# EAGLE design TL2P2 (EAGLE 7.7.0)
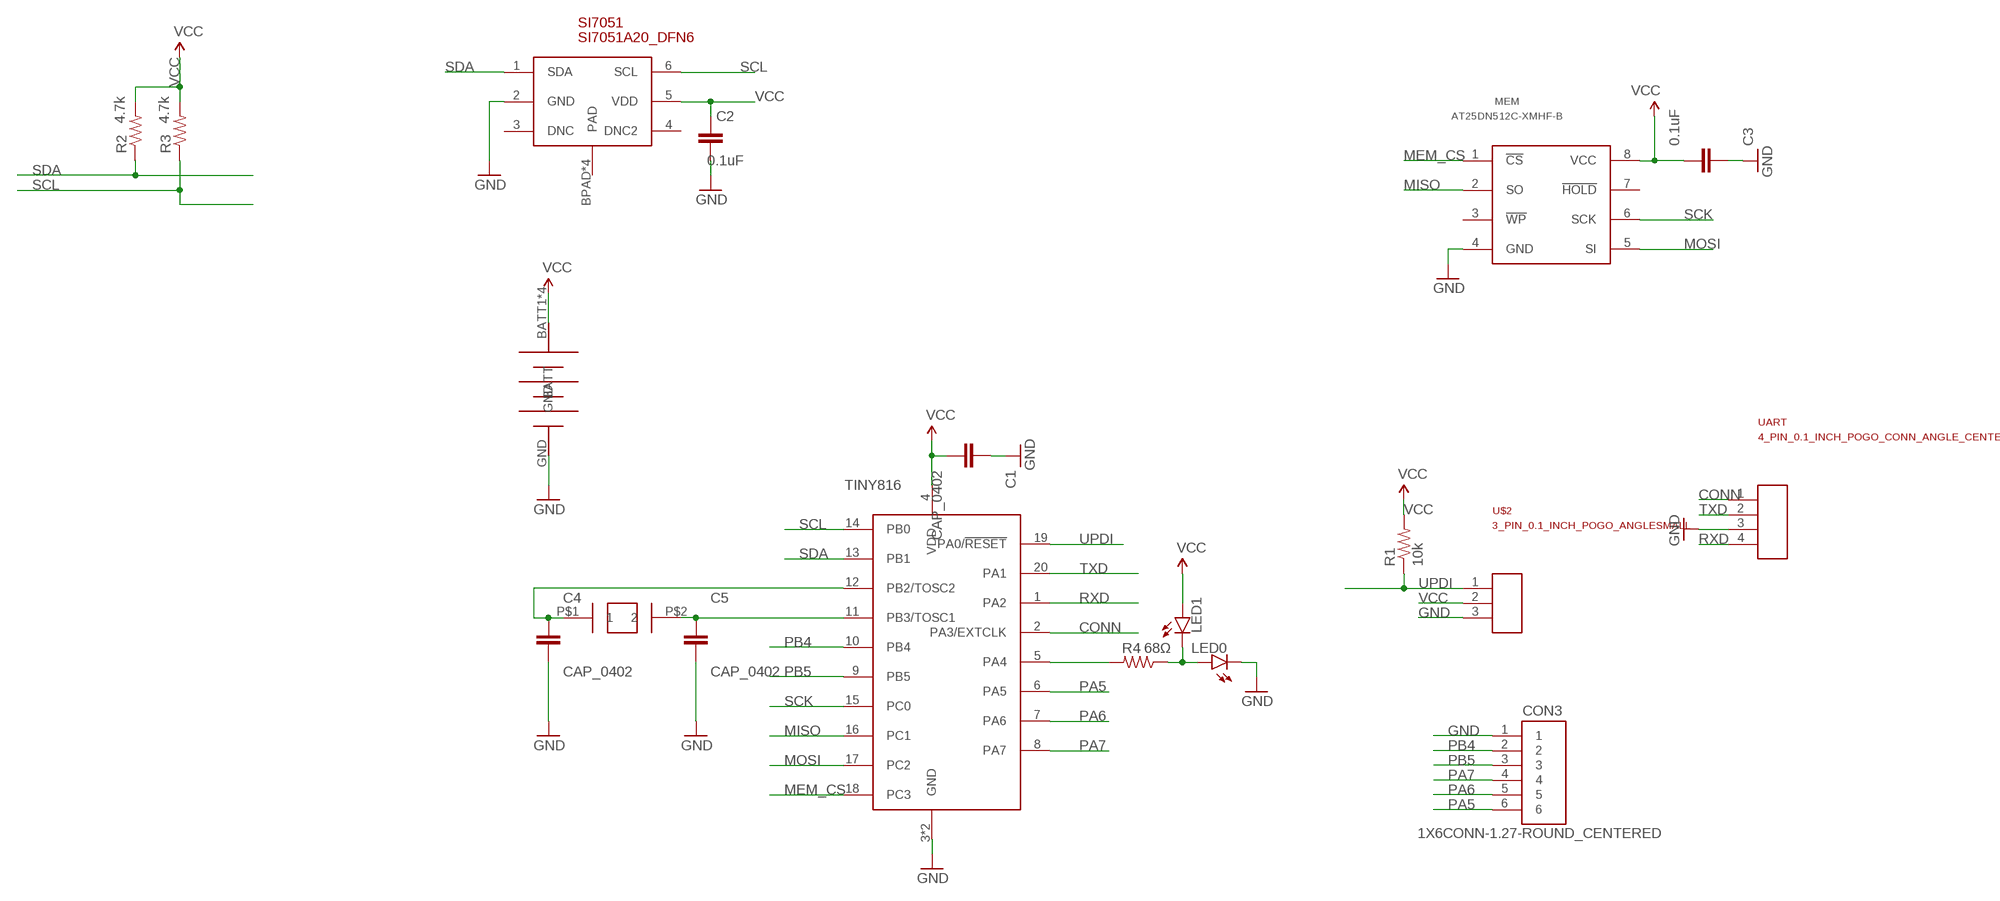
[diagram p0: schematic, sheet 1]

## Parts
C1  CAP_0402  [SMD_0402]
C2  0.1uF  CAP_0402  [SMD_0402]
C3  0.1uF  CAP_0402  [SMD_0402]
C4  CAP_0402  [SMD_0402]
C5  CAP_0402  [SMD_0402]
CON3  1X6CONN-1.27-ROUND_CENTERED  [1X6_1.27_ROUND_CENTERED]
LED0  LED  [SMD_0402@1]
LED1  LED  [SMD_0402@1]
MEM  AT25DN512C-XMHF-B  [TSSOP-8]
R1  10k  RESISTOR0402  [SMD_0402@1]
R2  4.7k  RESISTOR0402  [SMD_0402@1]
R3  4.7k  RESISTOR0402  [SMD_0402@1]
R4  68Ω  RESISTOR0402  [SMD_0402@1]
SI7051  SI7051A20_DFN6  [SI7051A20_DFN6]
T1  ABS07AIG  [ABS07AIG]
TINY816  ATTINY816-20  [ATTINY816-VQFN20]
U$1  LINX-CR2032-BAT-HLD-THM  [CR2032-LINX-THM]
U$2  3_PIN_0.1_INCH_POGO_ANGLESMALL  [3_PIN_0.1INCH_POGO_ANGLE_SMALL]
UART  4_PIN_0.1_INCH_POGO_CONN_ANGLE_CENTERED  [4_PIN_0.1"_POGO_ANGLE_CENTERED]

## Nets
CONN: TINY816.2(PA3/EXTCLK) UART.1
GND [GND]: C1.1 C2.1 C3.1 C4.2 C5.2 CON3.1 LED0.2(C) MEM.4(GND) SI7051.2(GND) TINY816.3(GND) TINY816.PAD(GND) U$1.GND U$2.3 UART.3
MEM_CS: MEM.1(!CS!) TINY816.18(PC3)
MISO: MEM.2(SO) TINY816.16(PC1)
MOSI: MEM.5(SI) TINY816.17(PC2)
N$1: LED0.1(A) LED1.2(C) R4.2
N$3 [Signal]: C5.1 T1.P$2 TINY816.11(PB3/TOSC1)
N$4 [Signal]: C4.1 T1.P$1 TINY816.12(PB2/TOSC2)
PA4_LED: R4.1 TINY816.5(PA4)
PA5: CON3.6 TINY816.6(PA5)
PA6: CON3.5 TINY816.7(PA6)
PA7: CON3.4 TINY816.8(PA7)
PB4: CON3.2 TINY816.10(PB4)
PB5: CON3.3 TINY816.9(PB5)
RXD [Signal]: TINY816.1(PA2) UART.4
SCK: MEM.6(SCK) TINY816.15(PC0)
SCL [Signal]: R3.2 SI7051.6(SCL) TINY816.14(PB0)
SDA [Signal]: R2.2 SI7051.1(SDA) TINY816.13(PB1)
TXD [Signal]: TINY816.20(PA1) UART.2
UPDI [Signal]: R1.2 TINY816.19(PA0/!RESET!) U$2.1
VCC: C1.2 C2.2 C3.2 LED1.1(A) MEM.8(VCC) R1.1 R2.1 R3.1 SI7051.5(VDD) TINY816.4(VDD) U$1.BATT1(BATT) U$1.BATT2(BATT) U$1.BATT3(BATT) U$1.BATT4(BATT) U$2.2
Unconnected: MEM.3(!WP!) MEM.7(!HOLD!) SI7051.3(DNC) SI7051.4(DNC2) SI7051.BPAD(PAD) SI7051.PAD SI7051.VIA1(PAD) SI7051.VIA2(PAD)

## Library data of the parts
C1-C5 = Passives:CAP_0402: 0402 capacitor
CON3 = AVR_ISP_127:1X6CONN-1.27-ROUND_CENTERED
LED0 LED1 = Passives:LED
MEM = Memory:AT25DN512C-XMHF-B
R1-R4 = Passives:RESISTOR
SI7051 = SI7051A20:SI7051A20_DFN6: SI7051A20 Temperature Sensor by Silicon Labs
T1 = ABS07AIG:ABS07AIG: Abracon ABS07AIG crystal
TINY816 = ATTiny:ATTINY816-20: Attiny441-MU, 4mm QFN package without bottom pad.
U$1 = Battery_holders:LINX-CR2032-BAT-HLD-THM
U$2 = Connectors:3_PIN_0.1_INCH_POGO_ANGLE
UART = Connectors:4_PIN_0.1_INCH_POGO_CONN_ANGLE_CENTERED

## Net classes
1 GND: width 0.254 mm, drill 0.305 mm, clearance 0.356 mm
2 Signal: width 0.152 mm, drill 0.305 mm, clearance 0.152 mm

## Board
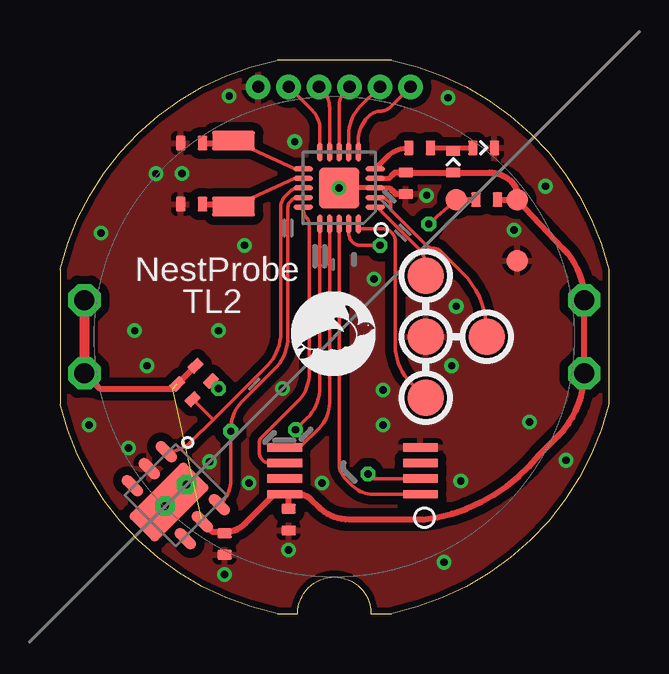
[diagram p1: board, top side]
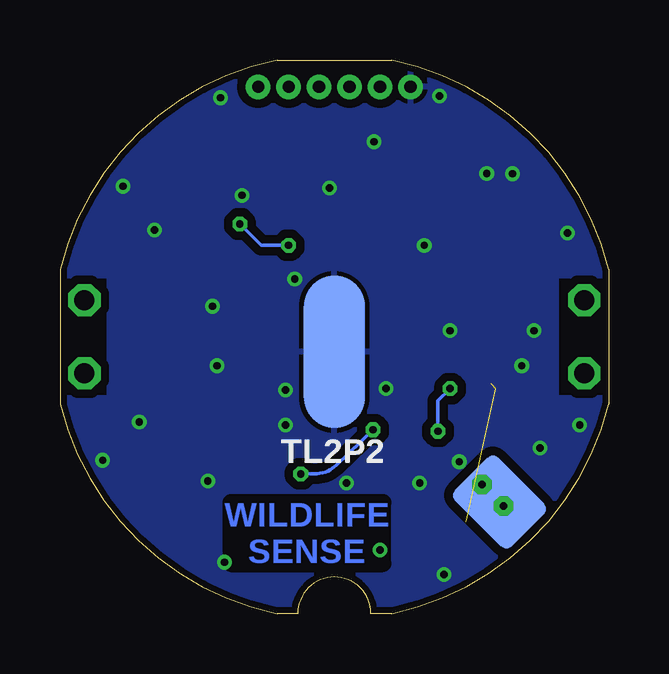
[diagram p2: board, bottom side, seen from below]

Size 22.86 x 23.06 mm. Coordinates in mm from the lower left corner, seen from the top.
Outline: 13.82,23.06 9.04,23.06 arc64 0,14.35 0,8.71 arc64 9.04,0 9.91,0 arc-180 12.95,0 13.82,0 arc64 22.86,8.71 22.86,14.35 arc64 13.82,23.06
Copper layers (1*16): Top 0.035mm / dielectric 1.5mm / Bottom 0.035mm
Design rules "Nikos-SeeedStudio_2layer_DRU_no_angle_20140221": minimum track width 6mil, minimum drill 12mil, track to track 6mil, track to pad 10mil, pad to pad 10mil, via to via 10mil, smd to smd 6mil, copper to edge 10mil, drill to drill 10mil, minimum pad ring 10mil, minimum via ring 6mil, stop-mask expansion 0mil, vias tented up to drill 100mil, thermal gap 8mil

### Footprints (pad centres in the part's own frame; a part is rotated, then mirrored left to right if it is on the bottom)
SMD_0402 = smd 0.6 x 0.4: 1 0,0.45; 2 0,-0.45
1X6_1.27_ROUND_CENTERED = drill 0.508 pad 0.813: 1 -3.175,0; 2 -1.905,0; 3 -0.635,0; 4 0.635,0; 5 1.905,0; 6 3.175,0
SMD_0402@1 = smd 0.6 x 0.4: 1 0,0.45; 2 0,-0.45
TSSOP-8 = smd 1.45 x 0.35: 1 -2.825,0.975; 2 -2.825,0.325; 3 -2.825,-0.325; 4 -2.825,-0.975; 5 2.825,-0.975; 6 2.825,-0.325; 7 2.825,0.325; 8 2.825,0.975
SI7051A20_DFN6 = smd 1.075 x 0.45: 1 -1.562,1; 2 -1.562,0; 3 -1.562,-1; 4 1.562,-1; 5 1.562,0; 6 1.562,1 | smd 2.54 x 3.34 bottom: BPAD 0,-0.4 | smd 1.6 x 3.3: PAD 0,-0.4 | drill 0.305 octagon: VIA1 0,0.635; VIA2 0,-0.635
ABS07AIG = smd 1.778 x 0.813: P$1 0,1.372; P$2 0,-1.372
ATTINY816-VQFN20 = smd 0.8 x 0.2: 1 -1.5,0.8; 2 -1.5,0.4; 3 -1.5,0; 4 -1.5,-0.4; 5 -1.5,-0.8; 11 1.5,-0.8; 12 1.5,-0.4; 13 1.5,0; 14 1.5,0.4; 15 1.5,0.8 | smd 0.2 x 0.8: 6 -0.8,-1.5; 7 -0.4,-1.5; 8 0,-1.5; 9 0.4,-1.5; 10 0.8,-1.5; 16 0.8,1.5; 17 0.4,1.5; 18 0,1.5; 19 -0.4,1.5; 20 -0.8,1.5 | smd 1.7 x 1.7: PAD 0,0
CR2032-LINX-THM = drill 0.838 octagon: BATT1 -10.414,1.524; BATT2 -10.414,-1.524; BATT3 10.414,-1.524; BATT4 10.414,1.524 | smd 2.54 x 6.35: GND 0,-0.635
3_PIN_0.1INCH_POGO_ANGLE_SMALL = smd 0.889 x 0.889: 1 0,0; 2 -2.54,0; 3 -2.54,2.54
4_PIN_0.1"_POGO_ANGLE_CENTERED = smd 1.524 x 1.524: 1 0,2.54; 2 2.54,0; 3 0,0; 4 -2.54,0

### Placement (x,y rotation side)
C1  14.41,17.93 180 top
C2  6.86,2.9 180 top
C3  9.53,3.91 180 top
C4  5.48,17.06 270 top
C5  5.48,19.6 270 top
CON3  11.43,21.95 0 top
LED0  17.65,19.41 90 top
LED1  16.38,18.82 180 top
MEM  12.19,5.94 180 top
R1  17.78,17.25 270 top
R2  5.21,9.25 45 top
R3  5.97,10.01 45 top
R4  14.99,19.41 90 top
SI7051  4.83,4.93 315 top
T1  7.23,18.33 180 top
TINY816  11.63,17.73 180 top
U$1  11.43,11.53 0 bottom
U$2  16.51,17.25 180 top
U$3  [WILDLIFE-SENSE]  11.43,11.53 0 top
UART  15.24,11.53 270 top

### Tracks (layer width: path | path; a pad name or v marks a point on that pad's centre or on a via)
CONN
  Top 0.152: TINY816.2 13.52,17.33 13.78,17.07 13.78,16.83 15.28,15.33 arc45 15.56,15.21 arc-45 15.88,15.08 16.78,14.18 arc-45 17.78,11.77 UART.1
GND  (via drill 0.3)
  Top 0.198: TINY816.3 TINY816.PAD
  Top 0.201: TINY816.3 13.74,17.73 13.84,17.63
  Top 0.254: 13.84,17.63 13.99,17.48 C1.1
  other vias: 11.63,17.73 1.71,15.85 7.05,21.56 4,18.33 7.68,15.34 15.28,17.42 16.51,12.8 2.86,6.9 6.22,6.32 3.11,11.79 19.56,7.98 13.46,7.85 7.87,5.44 5.08,18.33 16,2.13 6.86,1.63 18.92,15.98 9.78,19.66 6.6,11.79 3.62,10.33 1.21,7.85 9.27,9.37 16.7,5.52 13.46,9.31 13.08,13.94 16.32,10.33 21.08,6.39 16.17,21.49 20.23,17.81 10.92,5.44 9.53,2.64
  pour Bottom: -1.27,-1.17 24.13,-1.17 24.13,24.23 -1.27,24.23
  pour Top: -1.27,-1.17 24.13,-1.17 24.13,24.23 -1.27,24.23
MEM_CS
  Top 0.152: TINY816.18 11.63,6.24 arc45 11.89,5.61 12.17,5.33 arc45 13.04,4.97 MEM.1
MISO  (via drill 0.3)
  Top 0.152: TINY816.16 10.83,9.43 arc-45 10.29,8.13 v9.82,7.66 | v12.83,5.82 13.03,5.62 MEM.2
  Bottom 0.152: v9.82,7.66 11.34,6.19 arc44 12.25,5.82 v12.83,5.82
MOSI
  Top 0.152: TINY816.17 11.23,8.76 arc-45 10.8,7.73 9.99,6.92 MEM.5
N$1
  Top 0.201: R4.2 16.51,19.41 | 16.51,19.41 LED0.1 | LED1.2 16.51,19.41
N$2
  cutout Bottom: 2.03,9.12 2.03,13.94 0,13.94 0,9.12
  cutout Bottom: 22.73,9.12 22.73,13.94 20.96,13.94 20.96,9.12
N$3
  Top 0.152: TINY816.11 9.78,18.53 T1.P$2
  Top 0.254: C5.1 7.23,19.6 T1.P$2
N$4
  Top 0.152: TINY816.12 9.78,18.13 T1.P$1
  Top 0.254: C4.1 7.23,17.06 T1.P$1
PA4_LED
  Top 0.201: TINY816.5 13.63,19.03 arc-45 R4.1
PA5
  Top 0.152: TINY816.6 12.43,19.72 arc-45 12.82,20.67 12.89,20.74 arc-45 13.35,20.93 arc45 13.76,21.1 CON3.6
PA6
  Top 0.152: TINY816.7 12.03,19.98 arc-45 12.5,21.11 CON3.5
PA7
  Top 0.152: TINY816.8 11.63,21.12 arc-45 11.9,21.78 CON3.4
PB4
  Top 0.152: TINY816.10 10.83,20.18 arc45 10.51,20.96 CON3.2
PB5
  Top 0.152: TINY816.9 11.23,21.08 arc45 10.92,21.82 CON3.3
RXD
  Top 0.152: TINY816.1 13.22,16.93 14.91,15.24 arc-45 15.24,14.44 UART.4
SCK
  Top 0.152: TINY816.15 10.13,16.84 arc45 10.27,16.5 arc-45 10.39,16.21 10.39,10.01 arc-45 9.9,8.84 8.38,7.31 arc45 8.31,7.13 8.31,6.71 arc45 8.43,6.4 arc45 8.75,6.27 MEM.6
SCL  (via drill 0.3)
  Top 0.152: TINY816.14 9.94,17.33 arc45 9.63,17.2 9.58,17.15 arc45 9.5,16.95 9.5,11.54 arc-45 8.94,10.18 7.58,8.83 arc45 7.11,7.69 v7.11,7.59 7.11,5.55 arc-45 6.72,4.62 SI7051.6 6.76,4.66 | R3.2 v6.6,9.37 | v6.6,9.37
  Bottom 0.152: v6.6,9.37 7.11,8.86 v7.11,7.59
SDA
  Top 0.152: TINY816.13 9.97,17.73 arc45 9.56,17.56 9.38,17.38 arc45 9.2,16.94 9.2,11.67 arc-45 8.65,10.35 6.38,8.08 | 6.38,8.08 5.47,7.17 arc-45 SI7051.1 | R2.2 6.38,8.08 | 6.38,8.08
TXD
  Top 0.152: UART.2 14.61,9.62 arc-45 13.97,11.17 13.97,15.5 arc45 13.81,15.88 13.8,15.89 arc45 13.47,16.03 12.43,16.03 TINY816.20
UPDI  (via drill 0.3)
  Top 0.152: TINY816.19 12.03,15.86 arc45 12.19,15.47 arc45 12.5,15.34 v13.34,15.34 | v15.37,16.23 U$2.1
  Top 0.254: U$2.1 R1.2
  Bottom 0.152: v13.34,15.34 14.48,15.34 v15.37,16.23
VCC  (2 unrouted)
  Top 0.152: C2.2 6.86,3.4
  Top 0.201: TINY816.4 13.72,18.13 13.72,18.14 13.84,18.26
  Top 0.254: 13.84,18.26 13.96,18.38 C1.2 14.43,18.37 LED1.1 17.89,18.37 arc-45 18.82,17.99 arc-45 19.05,17.42 U$2.2 | U$2.2 20.95,15.22 arc-45 U$1.BATT1 U$1.BATT2 arc-45 20.77,7.41 19.98,6.62 arc-45 15.1,3.91 12.05,3.91 arc-45 10.77,4.44 10.49,4.73 arc45 9.91,4.97 MEM.8 | R1.1 U$2.2 | SI7051.5 6.35,3.4 6.86,3.4 6.87,3.4 arc45 7.72,3.76 8.93,4.97 MEM.8 | C3.2 9.53,4.97 MEM.8 | U$1.BATT3 1.65,9.37 4.7,9.37 R3.1
  Top 0.406: U$1.BATT4 U$1.BATT3

### Text on the board
Bottom: WILDLIFE / SENSE
tPlace: NestProbe / TL2
bPlace: TL2P2